# Altium schematic sheet [14] - CONNECTORS.SchDoc: CONNECTORS
size B; Organization: Altium Limited; Address1: L3, 12a Rodborough Rd; Address2: Frenchs Forest; Address3: NSW; Address4: Australia 2086; DocumentNumber: 14; Revision: V1I1; SheetNumber: 14; SheetTotal: 16
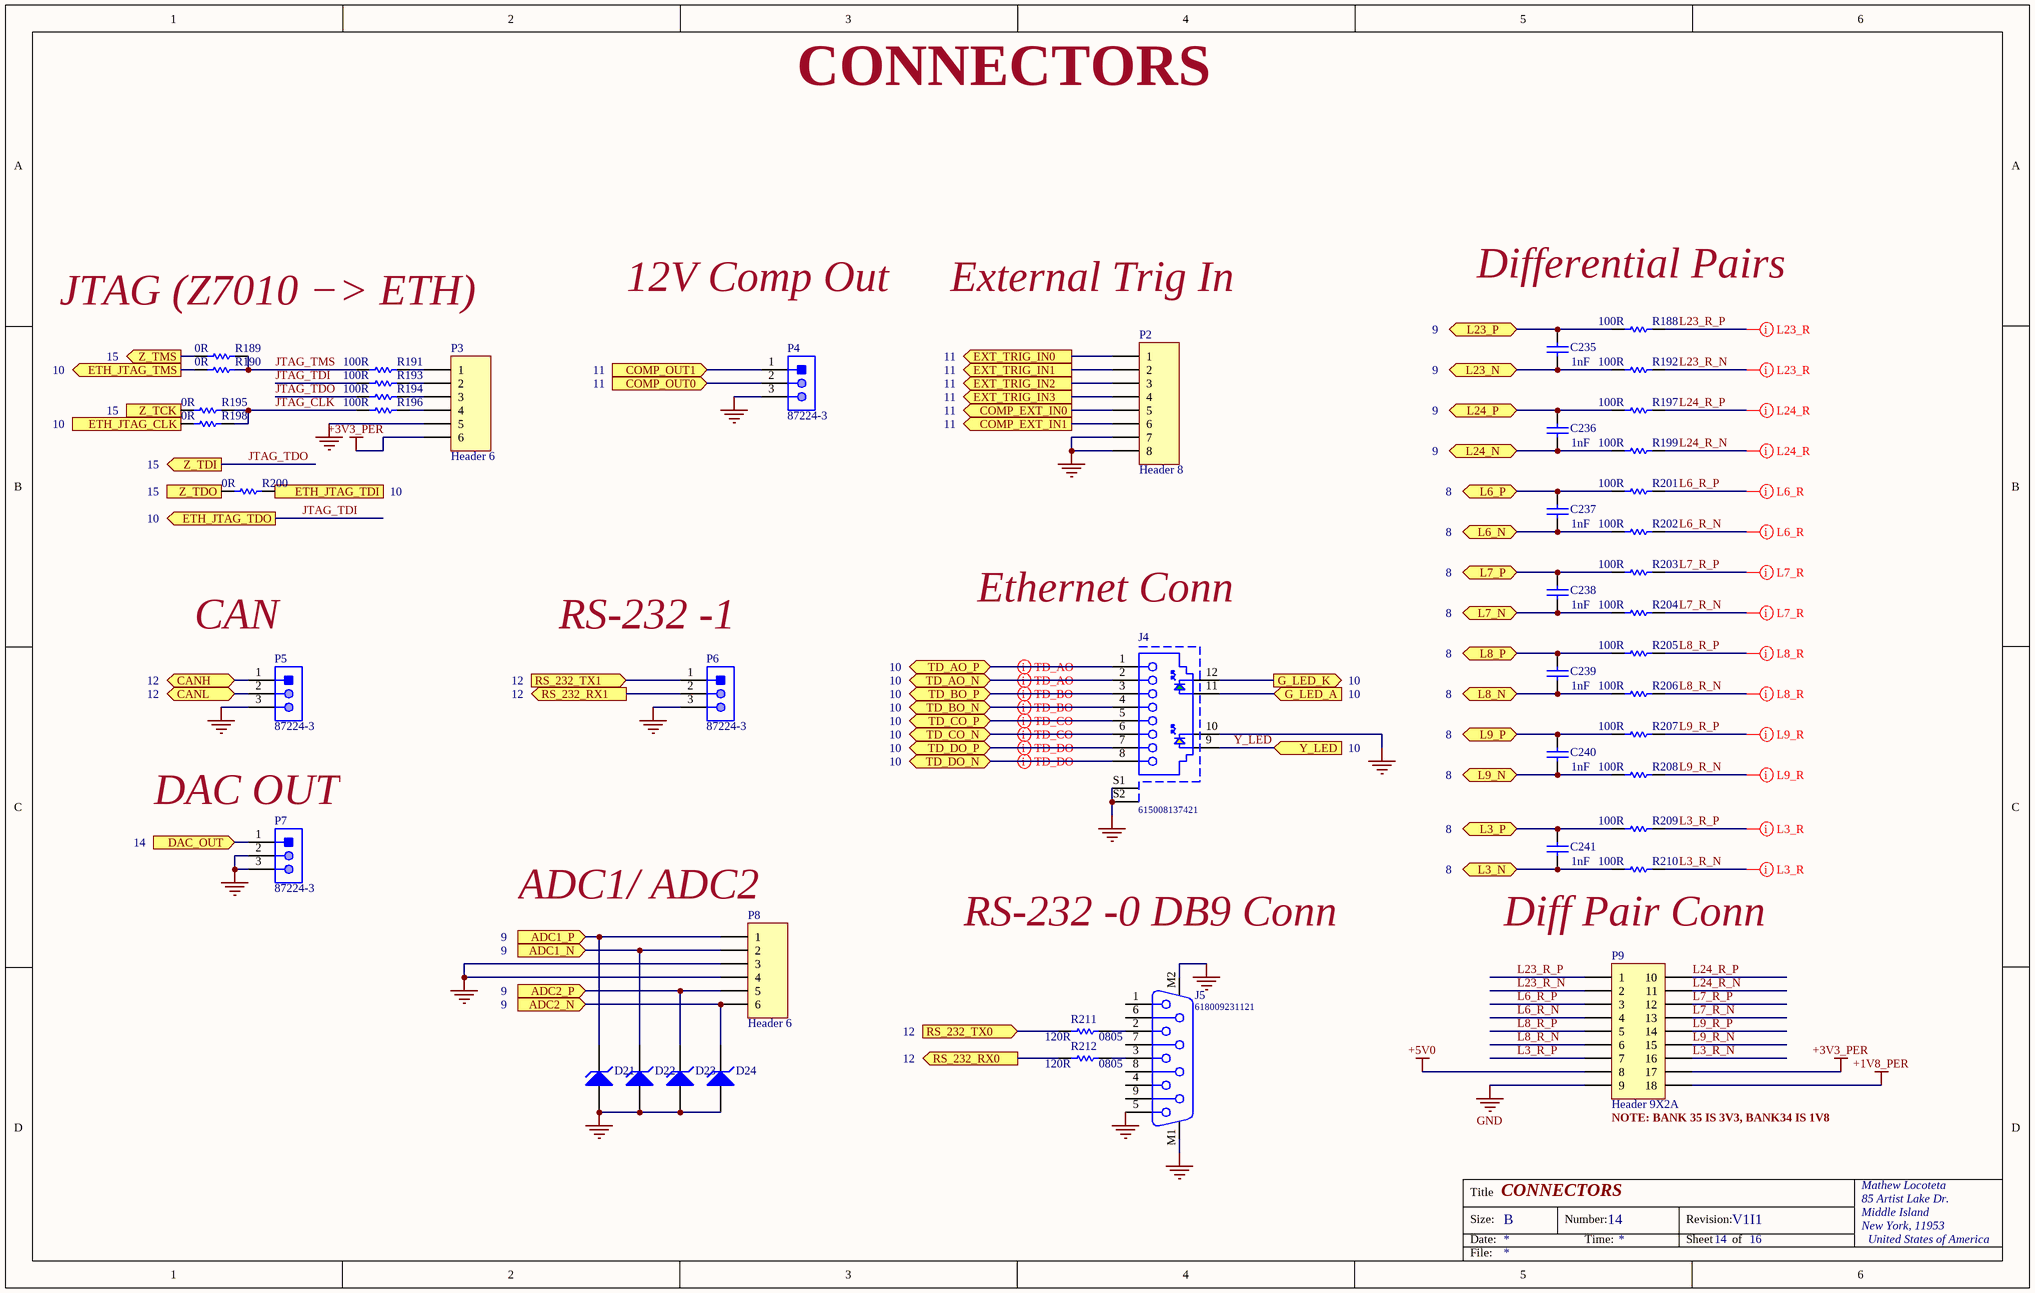
[diagram p0: [14] - CONNECTORS.SchDoc]

## Parts
C235  value 1nF  [CAPC1005X55X25LL05T10]  (hidden comment: GRM1555C1H102JA01D)
C236  value 1nF  [CAPC1005X55X25LL05T10]  (hidden comment: GRM1555C1H102JA01D)
C237  value 1nF  [CAPC1005X55X25LL05T10]  (hidden comment: GRM1555C1H102JA01D)
C238  value 1nF  [CAPC1005X55X25LL05T10]  (hidden comment: GRM1555C1H102JA01D)
C239  value 1nF  [CAPC1005X55X25LL05T10]  (hidden comment: GRM1555C1H102JA01D)
C240  value 1nF  [CAPC1005X55X25LL05T10]  (hidden comment: GRM1555C1H102JA01D)
C241  value 1nF  [CAPC1005X55X25LL05T10]  (hidden comment: GRM1555C1H102JA01D)
D21  ESD5Z2.5T1G  [ONSC-SOD-523-2-502-01_V]  (value not drawn)
D22  ESD5Z2.5T1G  [ONSC-SOD-523-2-502-01_V]  (value not drawn)
D23  ESD5Z2.5T1G  [ONSC-SOD-523-2-502-01_V]  (value not drawn)
D24  ESD5Z2.5T1G  [ONSC-SOD-523-2-502-01_V]  (value not drawn)
J4  615008137421  [615008137421]
J5  618009231121  [618009231121]
P2  Header 8  [HDR1X8]
P3  Header 6  [HDR1X6]
P4  87224-3  [TECO-87224-3_V]
P5  87224-3  [TECO-87224-3_V]
P6  87224-3  [TECO-87224-3_V]
P7  87224-3  [TECO-87224-3_V]
P8  Header 6  [HDR1X6]
P9  Header 9X2A  [HDR2X9_CEN]
R188  Parameter: 100R  [RESC1005X40X25NL05T05]  (hidden comment: CRCW0402100RFKED)
R189  0R  [R0402]
R190  0R  [R0402]
R191  Parameter: 100R  [RESC1005X40X25NL05T05]  (hidden comment: CRCW0402100RFKED)
R192  Parameter: 100R  [RESC1005X40X25NL05T05]  (hidden comment: CRCW0402100RFKED)
R193  Parameter: 100R  [RESC1005X40X25NL05T05]  (hidden comment: CRCW0402100RFKED)
R194  Parameter: 100R  [RESC1005X40X25NL05T05]  (hidden comment: CRCW0402100RFKED)
R195  0R  [R0402]
R196  Parameter: 100R  [RESC1005X40X25NL05T05]  (hidden comment: CRCW0402100RFKED)
R197  Parameter: 100R  [RESC1005X40X25NL05T05]  (hidden comment: CRCW0402100RFKED)
R198  0R  [R0402]
R199  Parameter: 100R  [RESC1005X40X25NL05T05]  (hidden comment: CRCW0402100RFKED)
R200  0R  [R0402]
R201  Parameter: 100R  [RESC1005X40X25NL05T05]  (hidden comment: CRCW0402100RFKED)
R202  Parameter: 100R  [RESC1005X40X25NL05T05]  (hidden comment: CRCW0402100RFKED)
R203  Parameter: 100R  [RESC1005X40X25NL05T05]  (hidden comment: CRCW0402100RFKED)
R204  Parameter: 100R  [RESC1005X40X25NL05T05]  (hidden comment: CRCW0402100RFKED)
R205  Parameter: 100R  [RESC1005X40X25NL05T05]  (hidden comment: CRCW0402100RFKED)
R206  Parameter: 100R  [RESC1005X40X25NL05T05]  (hidden comment: CRCW0402100RFKED)
R207  Parameter: 100R  [RESC1005X40X25NL05T05]  (hidden comment: CRCW0402100RFKED)
R208  Parameter: 100R  [RESC1005X40X25NL05T05]  (hidden comment: CRCW0402100RFKED)
R209  Parameter: 100R  [RESC1005X40X25NL05T05]  (hidden comment: CRCW0402100RFKED)
R210  Parameter: 100R  [RESC1005X40X25NL05T05]  (hidden comment: CRCW0402100RFKED)
R211  value 120R  Case: 0805  [RESC2013X50X30LL20T20]  (hidden comment: CRCW0805120RJNEA)
R212  value 120R  Case: 0805  [RESC2013X50X30LL20T20]  (hidden comment: CRCW0805120RJNEA)

## Ports
ADC1_N (in), ADC1_P (in), ADC2_N (in), ADC2_P (in), CANH (bidir), CANL (bidir), COMP_EXT_IN0 (out), COMP_EXT_IN1 (out), COMP_OUT0 (in), COMP_OUT1 (in), DAC_OUT (in), ETH_JTAG_CLK (out), ETH_JTAG_TDI (out), ETH_JTAG_TDO (out), ETH_JTAG_TMS (out), EXT_TRIG_IN0 (out), EXT_TRIG_IN1 (out), EXT_TRIG_IN2 (out), EXT_TRIG_IN3 (out), G_LED_A (in), G_LED_K (out), L3_N (bidir), L3_P (bidir), L6_N (bidir), L6_P (bidir), L7_N (bidir), L7_P (bidir), L8_N (bidir), L8_P (bidir), L9_N (bidir), L9_P (bidir), L23_N (bidir), L23_P (bidir), L24_N (bidir), L24_P (bidir), RS_232_RX0 (out), RS_232_RX1 (out), RS_232_TX0 (in), RS_232_TX1 (in), TD_AO_N (bidir), TD_AO_P (bidir), TD_BO_N (bidir), TD_BO_P (bidir), TD_CO_N (bidir), TD_CO_P (bidir), TD_DO_N (bidir), TD_DO_P (bidir), Y_LED (in), Z_TCK (out), Z_TDI (out), Z_TDO (in), Z_TMS (out)

## Nets
+1V8_PER: P9.18
+3V3_PER: P3.6 P9.17
+5V0: P9.8
GND: D21.2(A) D22.2(A) D23.2(A) D24.2(A) J4.10 J4.S1 J4.S2 J5.5 J5.M1 J5.M2 P2.7 P2.8 P3.5 P4.3 P5.3 P6.3 P7.2 P7.3 P8.3 P8.4 P9.9
ADC1_N: D22.1(K) P8.2 ; port ADC1_N
ADC1_P: D21.1(K) P8.1 ; port ADC1_P
ADC2_N: D24.1(K) P8.6 ; port ADC2_N
ADC2_P: D23.1(K) P8.5 ; port ADC2_P
CANH: P5.1 ; port CANH
CANL: P5.2 ; port CANL
COMP_EXT_IN0: P2.5 ; port COMP_EXT_IN0
COMP_EXT_IN1: P2.6 ; port COMP_EXT_IN1
COMP_OUT0: P4.2 ; port COMP_OUT0
COMP_OUT1: P4.1 ; port COMP_OUT1
DAC_OUT: P7.1 ; port DAC_OUT
ETH_JTAG_CLK: R198.1 ; port ETH_JTAG_CLK
ETH_JTAG_TDI: R200.2 ; port ETH_JTAG_TDI
ETH_JTAG_TMS: R190.1 ; port ETH_JTAG_TMS
EXT_TRIG_IN0: P2.1 ; port EXT_TRIG_IN0
EXT_TRIG_IN1: P2.2 ; port EXT_TRIG_IN1
EXT_TRIG_IN2: P2.3 ; port EXT_TRIG_IN2
EXT_TRIG_IN3: P2.4 ; port EXT_TRIG_IN3
G_LED_A: J4.11 ; port G_LED_A
G_LED_K: J4.12 ; port G_LED_K
JTAG_CLK: R195.2 R196.1 R198.2
JTAG_TDI: R193.1 ; port ETH_JTAG_TDO
JTAG_TDO: R194.1 ; port Z_TDI
JTAG_TMS: R189.2 R190.2 R191.1
L3_N: C241.1 R210.1 ; port L3_N
L3_P: C241.2 R209.1 ; port L3_P
L3_R_N: P9.16 R210.2
L3_R_P: P9.7 R209.2
L6_N: C237.1 R202.1 ; port L6_N
L6_P: C237.2 R201.1 ; port L6_P
L6_R_N: P9.4 R202.2
L6_R_P: P9.3 R201.2
L7_N: C238.1 R204.1 ; port L7_N
L7_P: C238.2 R203.1 ; port L7_P
L7_R_N: P9.13 R204.2
L7_R_P: P9.12 R203.2
L8_N: C239.1 R206.1 ; port L8_N
L8_P: C239.2 R205.1 ; port L8_P
L8_R_N: P9.6 R206.2
L8_R_P: P9.5 R205.2
L9_N: C240.1 R208.1 ; port L9_N
L9_P: C240.2 R207.1 ; port L9_P
L9_R_N: P9.15 R208.2
L9_R_P: P9.14 R207.2
L23_N: C235.1 R192.1 ; port L23_N
L23_P: C235.2 R188.1 ; port L23_P
L23_R_N: P9.2 R192.2
L23_R_P: P9.1 R188.2
L24_N: C236.1 R199.1 ; port L24_N
L24_P: C236.2 R197.1 ; port L24_P
L24_R_N: P9.11 R199.2
L24_R_P: P9.10 R197.2
RS_232_RX0: R212.1 ; port RS_232_RX0
RS_232_RX1: P6.2 ; port RS_232_RX1
RS_232_TX0: R211.1 ; port RS_232_TX0
RS_232_TX1: P6.1 ; port RS_232_TX1
TD_AO_N: J4.2 ; port TD_AO_N
TD_AO_P: J4.1 ; port TD_AO_P
TD_BO_N: J4.4 ; port TD_BO_N
TD_BO_P: J4.3 ; port TD_BO_P
TD_CO_N: J4.6 ; port TD_CO_N
TD_CO_P: J4.5 ; port TD_CO_P
TD_DO_N: J4.8 ; port TD_DO_N
TD_DO_P: J4.7 ; port TD_DO_P
Y_LED: J4.9 ; port Y_LED
Z_TCK: R195.1 ; port Z_TCK
Z_TDO: R200.1 ; port Z_TDO
Z_TMS: R189.1 ; port Z_TMS
NetJ5_2: J5.2 R211.2
NetJ5_3: J5.3 R212.2
NetP3_1: P3.1 R191.2
NetP3_2: P3.2 R193.2
NetP3_3: P3.3 R194.2
NetP3_4: P3.4 R196.2

Not connected (* = marked no-connect by the designer): J5 1 4 6 7 8 9

## Layout directives
differential pair: L3_R_N, L3_R_P, L6_R_N, L6_R_P, L7_R_N, L7_R_P, L8_R_N, L8_R_P, L9_R_N, L9_R_P, L23_R_N, L23_R_P, L24_R_N, L24_R_P, TD_AO_N, TD_AO_P, TD_BO_N, TD_BO_P, TD_CO_N, TD_CO_P, TD_DO_N, TD_DO_P

## Notes on the sheet
- CONNECTORS
- 12V Comp Out
- External Trig In
- Differential Pairs
- JTAG (Z7010 −> ETH)
- 10
- 15
- 11
- 9
- 8
- (near P5) CAN
- (near P6) RS-232 -1
- Ethernet Conn
- 12
- 14
- (near P7) DAC OUT
- (near P8) ADC1/ ADC2
- RS-232 -0 DB9 Conn
- Diff Pair Conn
- Labels drawn without touching a wire or pin: NOTE: BANK 35 IS 3V3, BANK34 IS 1V8
- Title
- Size:
- Date:
- B
- Number:
- Time:
- Revision:
- Sheet
- of
- Mathew Locoteta
- 85 Artist Lake Dr.
- Middle Island
- New York, 11953
- United States of America
- File:

## Library data of the parts
C235-C241 = CMP-2008-04254-1: Manufacturer: Murata; Part Number: GRM1555C1H102JA01D
D21-D24 = CMP-1063-00103-1: Transient Voltage Suppressor, Micro-Packaged Diode for ESD Protection, 2-Pin SOD-523, Pb-Free, Tape and Reel; Manufacturer: On Semiconductor; Direction: Unidirectional; PPK Max (W): 120; V(BR) Min (V): 4; VRWM Max (V): 2.5; Number of Lines: 1; IR Max (uA): 6; ComponentLink3Description: Package Specification; Packing: Tape and Reel; ComponentLink2URL: http://www.onsemi.cn/pub_link/Collateral/ESD5Z2.5T1-D.PDF; ComponentLink3URL: http://www.onsemi.com/pub_link/Collateral/502-01.PDF; PackageReference: SOD-523-2-502-01; PartNumber: ESD5Z2.5T1G; Mounting Technology: Surface Mount; DatasheetVersion: Rev. 10; PackageVersion: Rev. E, 09/2010; RoHS: Pb-Free; ComponentLink1Description: Manufacturer URL; PackageDescription: 2-Pin SOD, Body 1.2 x 0.8 mm; ComponentLink2Description: Datasheet; ComponentLink1URL: http://www.onsemi.com/
J4 = CMP-1502-01697-1: Modular Jack WR-MJ, Tab Up, Shielded, with LED and EMI Panel Finger, Horizontal Entry, THT, 8P8C; Manufacturer: Wurth Elektronik; Compliance: Leadfree/RoHS; Withstanding Voltage: 1000VAC; Port: 1x1; Contact Resistance: 20mOhm; Rated Current: 1.5A; Working Voltage: 120VAC; Manufacturer URL: http://www.we-online.de; Mounting Technology: THT; Entrance: Horizontal; Datasheet URL: https://katalog.we-online.de/em/datasheet/615008137421.pdf; Packaging: Tray; Package Reference: 615008137421; Publisher: WurthElektronik; Operating Temperature: -40to85degC; Part Number: 615008137421; Pin Number: 8P8C
J5 = CMP-1502-00200-1: Female PCB Connector with Hex Screw WR-DSUB, 8.08 mm, Angled, 9 pins; Manufacturer: Wurth Elektronik; Contact Resistance: 30mOhm; Pin Number: 9; Working Voltage: 125VAC; Rated Current: 3A; Gender: Female; Datasheet URL: https://katalog.we-online.de/em/datasheet/6180xx231121.pdf; Packaging: Tray; Package Reference: 618009231121; Operating Temperature: -40to85degC; Manufacturer URL: http://www.we-online.de; Publisher: WurthElektronik; Mounting Technology: THT; Part Number: 618009231121; Orientation: Angled
P2 = Header 8: Header, 8-Pin; LatestRevisionDate: 17-Jul-2002; LatestRevisionNote: Re-released for DXP Platform.; Publisher: Altium Limited
P3 P8 = Header 6: Header, 6-Pin; LatestRevisionDate: 17-Jul-2002; LatestRevisionNote: Re-released for DXP Platform.; Publisher: Altium Limited
P4-P7 = CMP-2000-05697-1: Male Header, Pitch 2.54 mm, 1 x 3 Position, Height 10.744 mm, Tail Length 3.175 mm, -65 to 105 degC, RoHS, Bulk; Manufacturer: TE Connectivity; Catalog Drawings: SingleSquareStraightPost / SingleSquareStraightPostSide; Connector Type: Header,Unshrouded; Pitch: 0.100"(2.54mm); Mating Products: 147738-2-ND / -CONNRCPT3POSVERTSMDGOLD / 147723-2-ND / -CONNRCPT3POSVERT.100GOLD / 146763-5-ND / -CONNRCPT3POSSGLVERT.100T/H / A32904-ND / -CONNRECEPT3POS.100VERTGOLD / A26922-ND / -CONNHOUSING3POS.100LOCKING / A26415-ND / -CONNRECEPT3POS.100VERTAU / A26964-ND / -CONNHOUSING3POS.100SINGLE / A3012-ND / -CONNHOUSING3POS.100SINGLE; Number of Positions Loaded: All; Featured Product: AMPMODUConnectors; Dynamic Catalog: AMPMODUModIISeries; 3D Model: 87224-3.pdf; Other Names: 87224-3-ND / A26545; Number of Positions: 3; RoHS Information: 87224-3StatementofCompliance; Termination: Solder; Datasheet URL: http://www.te.com/commerce/DocumentDelivery/DDEController?Action=showdoc&DocId=Customer+Drawing%7F87224%7FL3%7Fpdf%7FEnglish%7FENG_CD_87224_L3.pdf%7F87224-3; Category: Connectors,Interconnects; Contact Mating Length: 0.318"(8.08mm); Standard Package: 520; Mounting Type: ThroughHole; Family: RectangularConnectors-Headers,MalePins; Number of Rows: 1; Series: AMPMODUModII; Contact Finish Thickness: 15µin(0.38µm); Datasheet Version: Rev. L3, 08/2015; Package Reference: 87224-3; Mounting Technology: ThroughHole; Manufacturer URL: http://www.te.com/; Contact Type: MalePin; Packaging: Bulk; Color: Black; Package Description: Male Header, Pitch 2.54 mm, 1 x 3 Position, Height 10.744 mm, Tail Length 3.175 mm; Contact Finish: Gold
P9 = Header 9X2A: Header, 9-Pin, Dual row; LatestRevisionDate: 17-Jul-2002; LatestRevisionNote: Re-released for DXP Platform.; Publisher: Altium Limited
R188 R191-R194 R196 R197 R199 R201-R210 = CMP-2002-08127-1: Manufacturer: Vishay Dale; Part Number: CRCW0402100RFKED
R189 R190 R195 R198 R200 = RMCF0402ZT0R00: RES 0 OHM JUMPER 1/16W 0402; Manufacturer: Stackpole Electronics; Max Power Dissipation: 63mW; Current Rating: 1A; Working Voltage: 50V; Resistance: 0mR; Supplier 1: Digi-Key; Manufacturer Part Number: RMCF0402ZT0R00; RoHS: Yes; Category: Chip SMD Resistors; Stock 1: 3707577; Pricing 1: 1=0.10000, 10=0.01100, 25=0.00800, 50=0.00620, 100=0.00450, 250=0.00348, 500=0.00278, 1000=0.00204, 5000=0.00146 (USD); Mount: Surface Mount; Case/Package: 0402; Contact Plating: Tin,Matte; Case Code (Metric): 1005; Case Code (Imperial): 0402; Min Operating Temperature: -55°C; Max Operating Temperature: 155°C; Composition: Thick Film; Number of Terminations: 2; Military Standard: Not; Power Rating: 63mW; Packaging: Tape and Reel; Features: Automotive AEC-Q200; Length: 0.039inch; Height: 0.016inch; Depth: 0.5mm; Width: 0.02inch; Radiation Hardening: No; Lead Free: Lead Free; ComponentLink1URL: https://datasheet.ciiva.com/26835/getdatasheetpartid-409751-26835612.pdf?src-supplier=Verical; ComponentLink1Description: https://datasheet.ciiva.com/26835/getdatasheetpartid-409751-26835612.pdf?src-supplier=Verical; Supplier Part Number 1: RMCF0402ZT0R00DKR-ND
R211 R212 = CMP-2001-04288-1: Manufacturer: Vishay Dale; Part Number: CRCW0805120RJNEA